# Altium schematic sheet SensorRadiacion.SchDoc
size A4
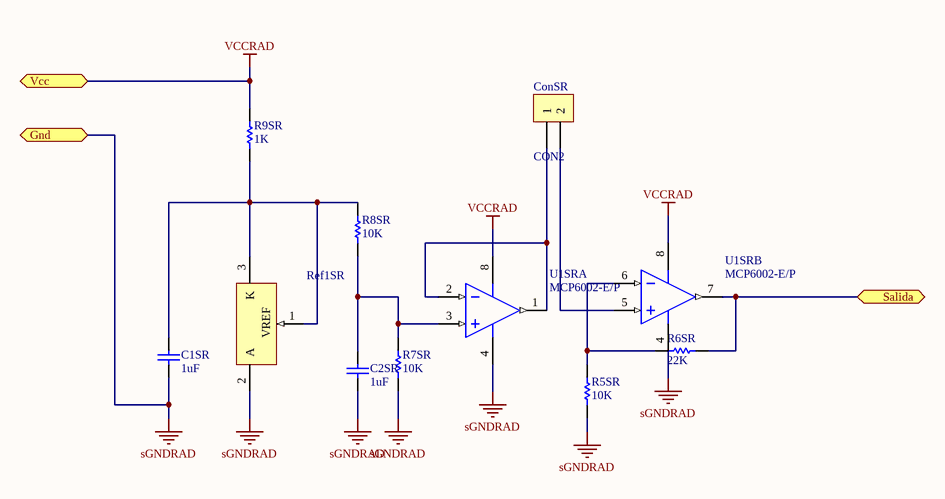
[diagram p0: SensorRadiacion.SchDoc]

## Parts
C1SR  1uF  [CAPPOL100]
C2SR  1uF  [CAPPOL100]
ConSR  CON2  [BORNERA2 - T]
R5SR  10K  [RES300]
R6SR  22K  [RES300]
R7SR  10K  [RES300]
R8SR  10K  [RES300]
R9SR  1K  [RES300]
Ref1SR  TL431ACLP  [LP03]  (value not drawn)
U1SR  MCP6002-E/P  [DIP8B]  (parts A,B of 2)

## Ports
Gnd, Salida, Vcc

## Nets
sGNDRAD: C1SR.1 C2SR.1 R5SR.1 R7SR.1 Ref1SR.2(A) U1SR.4(VSS) ; port Gnd
VCCRAD: R9SR.2 U1SR.8(VDD) ; port Vcc
Salida: R6SR.1 U1SR.7(VOUTB) ; port Salida
NetC1SR_2: C1SR.2 R8SR.2 R9SR.1 Ref1SR.1(VREF) Ref1SR.3(K)
NetC2SR_2: C2SR.2 R7SR.2 R8SR.1 U1SR.3(VINA+)
NetConSR_1: ConSR.1 U1SR.1(VOUTA) U1SR.2(VINA-)
NetConSR_2: ConSR.2 U1SR.5(VINB+)
NetR5SR_2: R5SR.2 R6SR.2 U1SR.6(VINB-)

## Library data of the parts
C1SR C2SR = CAP: Capacitor
ConSR = CON2: Conector 2
R5SR R6SR R7SR R8SR R9SR = RES: Resistencia
Ref1SR = TL431ACLP: Adjustable Precision Shunt Regulator; Published: 15-Apr-2002; LatestRevisionDate: 06-Jun-2005; LatestRevisionNote: Sch pins 1 & 3 swapped; DatasheetVersion: Oct-2000; PackageVersion: Nov-2001; PackageReference: LP03; Publisher: Altium Limited; PackageDescription: TO, Flat Index; 3 In-Line, Axial Leads; Body Dia. 4.8mm; Leads 0.56 x 0.41 mm (max); Code_JEDEC: TO-226-AA; ComponentLink1Description: Manufacturer Link; ComponentLink1URL: http://www.ti.com/; ComponentLink2Description: Datasheet; ComponentLink2URL: http://www-s.ti.com/sc/ds/tl431a.pdf
U1SR = MCP6002-E/P: 1 MHz, Low-Power Operational Amplifier, 8-Pin PDIP, Extended Temperature; Published: 29-Jan-2009; LatestRevisionDate: 02-Dec-2009; LatestRevisionNote: Updated to datasheet revision J, Nov-2009; DatasheetVersion: revJ, Nov-2009; PackageVersion: revBB, Aug-2009; PackageReference: PDIP300-P8; Publisher: Altium Limited; PackageDescription: 8-Lead Plastic Dual In-Line (P) - 300 mil Body [PDIP]; Supplier 1: Digi-Key; Supplier Part Number 1: MCP6002-E/P-ND; Supplier 2: Farnell; Supplier Part Number 2: 1332117; Code_JEDEC: MS-001; ComponentLink1Description: Datasheet; ComponentLink1URL: http://ww1.microchip.com/downloads/en/DeviceDoc/21733j.pdf; ComponentLink2Description: Packaging Specification; ComponentLink2URL: http://www.microchip.com/stellent/groups/techpub_sg/documents/packagingspec/en012702.pdf; ComponentLink3Description: Microchip.com Home; ComponentLink3URL: http://www.microchip.com/